# Altium project MPLAB-ICD-Breakout.PrjPcb
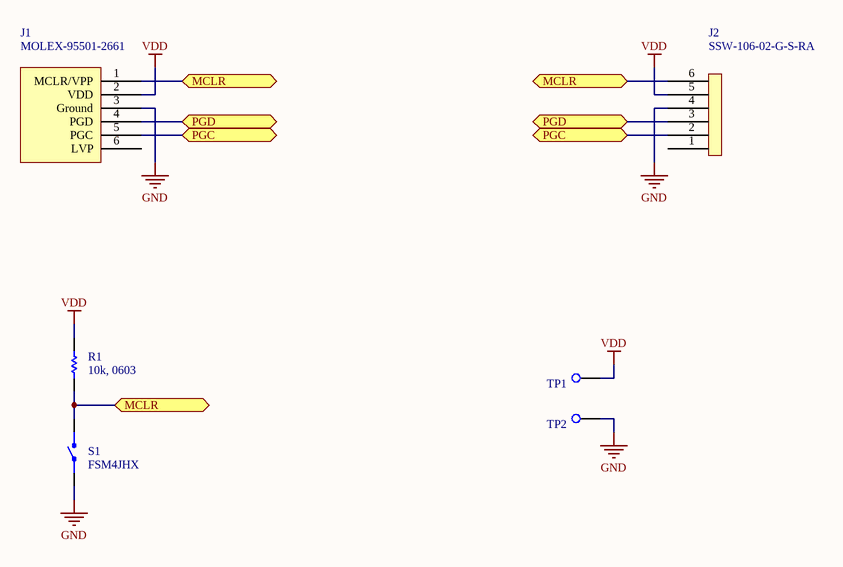
[diagram p0: Sheet1.SchDoc]
1 sheet, 6 parts. Net scope: flat (ports and power ports of the same name join across sheets).

## Sheet Sheet1.SchDoc
size A4

### Parts
J1  MOLEX-95501-2661  [Molex 95501-2661]
J2  SSW-106-02-G-S-RA  [SSW-106-02-G-S-RA]
R1  10k, 0603  [Resistor 0603]
S1  FSM4JHX  [FSM4JHX]
TP1  Test Point  [Keystone 5010]  (value not drawn)
TP2  Test Point  [Keystone 5011]  (value not drawn)

### Ports
MCLR, PGC, PGD

### Nets
GND: J1.3(Ground) J2.4 S1.1 TP2.1
VDD: J1.2(VDD) J2.5 R1.2 TP1.1
MCLR: J1.1(MCLR/VPP) J2.6 R1.1 S1.2 ; port MCLR
PGC: J1.5(PGC) J2.2 ; port PGC
PGD: J1.4(PGD) J2.3 ; port PGD

Not connected (* = marked no-connect by the designer): J1 6(LVP); J2 1

### Library data of the parts
J1 = MPLAB ICSP
R1 = Resistor
S1 = Switch